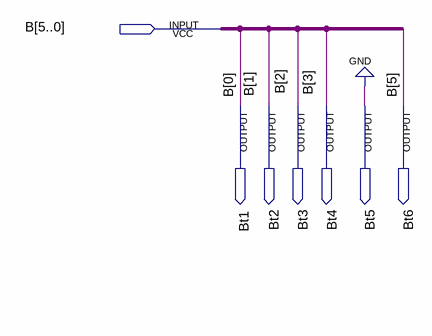
[diagram p0: schematic sheet]
// Quartus schematic subtrator_carry.bdf as structural Verilog: 0 symbols, 7 pins
module subtrator_carry (
  input  [5:0] B,
  output Bt1,
  output Bt2,
  output Bt3,
  output Bt4,
  output Bt5,
  output Bt6
);


  assign Bt1 = B[0];
  assign Bt2 = B[1];
  assign Bt3 = B[2];
  assign Bt4 = B[3];
  assign Bt5 = 1'b0;
  assign Bt6 = B[5];
endmodule
